# EAGLE schematic FT2323 USB to Serial (EAGLE 8.2.1)
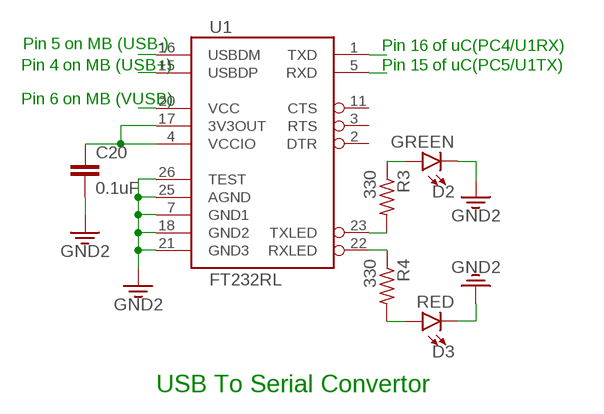
[diagram p0: schematic, sheet 1]

## Parts
C20  0.1uF  10UF-1206-6.3V-20%  [1206]
D2  GREEN  LED-WHITE1206  [LED-1206]
D3  RED  LED-WHITE1206  [LED-1206]
R3  330  R-US_M1206  [M1206]
R4  330  R-US_M1206  [M1206]
U1  FT232RL  FT232RL-BASICSSOP  [SSOP28DB]

## Nets
3.3V: C20.2 D2.C D3.C U1.7(GND1) U1.18(GND2) U1.21(GND3) U1.25(AGND) U1.26(TEST) ; supply symbol labelled GND2
N$67: R4.1 U1.22(RXLED)
N$68: R3.2 U1.23(TXLED)
N$69: D3.A R4.2
N$70: D2.A R3.1
N$77: C20.1 U1.4(VCCIO) U1.17(3V3OUT)
RXD: U1.1(TXD)
TXD: U1.5(RXD)
USB+: U1.15(USBDP)
USB-: U1.16(USBDM)
VUSB: U1.20(VCC)
Unconnected: U1.2(DTR) U1.3(RTS) U1.11(CTS)

## Notes on the sheet
- Pin 5 on MB (USB-) | Pin 16 of uC(PC4/U1RX)
- Pin 4 on MB (USB+) | Pin 15 of uC(PC5/U1TX)
- Pin 6 on MB (VUSB)
- USB To Serial Convertor

## Library data of the parts
C20 = SparkFun-Capacitors:10UF: 10.0µF ceramic capacitors A capacitor is a passive two-terminal electrical component used to store electrical energy temporarily in an electric field.; PROD_ID: CAP-10057; VALUE: 10uF
D2 D3 = SparkFun-LED:LED-WHITE: White SMD LED Used in manufacturing several products at SparkFun. Packages: 0603 - Bright White SMD 0603 package[Product Link] <http://www.kingbrightusa.com/product.asp?catalog_name=LED&product_id=APT1608QWF/D> 1206 - Bright White SMD1206 package [Product Link] <http://www.kingbrightusa.com/product.asp?catalog_name=LED&product_id=APT3216QWF/D> SparkFun Products: Blackberry Trackballer Breakout <https://www.sparkfun.com/products/13169> Digital SandBox <https://www.sparkfun.com/products/12651>; PROD_ID: DIO-09955; VALUE: WHITE
R3 R4 = adafruit:R-US_: RESISTOR, American symbol
U1 = SparkFun-IC-Comms:FT232RL-BASIC: FT232RL USB UART This is the simplified version of the FT232RL unit. Only what you need, nothing you don't. FT232RL 4th Generation USB UART (USB <-> Serial) Controller. Datasheet <http://www.sparkfun.com/datasheets/IC/FT232R_v104.pdf> SparkFun Products Component <https://www.sparkfun.com/products/650> (COM-00650) SparkFun RedBot Mainboard <https://www.sparkfun.com/products/12097> (ROB-12097) SparkFun FTDI Basic Breakout - 5V <https://www.sparkfun.com/products/9716> (DEV-09716) SparkFun FTDI Basic Breakout - 3.3V <https://www.sparkfun.com/products/9873> (DEV-09873) Bus Pirate - v3.6a <https://www.sparkfun.com/products/12942> (TOL-12942) SparkFun USB to Serial Breakout - FT232RL <https://www.sparkfun.com/products/12731> (BOB-12731) SparkFun PicoBoard <https://www.sparkfun.com/products/11888> (WIG-11888) SparkFun RFID USB Reader <https://www.sparkfun.com/products/9963> (SEN-09963) LilyPad FTDI Basic Breakout - 5V <https://www.sparkfun.com/products/10275> (DEV-10275) SparkFun Stepoko <https://www.sparkfun.com/products/13899> (ROB-13899); PROD_ID: IC-00870

## Net classes
0 default: width 0.2 mm, clearance 0.2 mm
1 VSERVO: width 0.8 mm, clearance 0.2 mm